# Altium project USB-Hub.PrjPcb
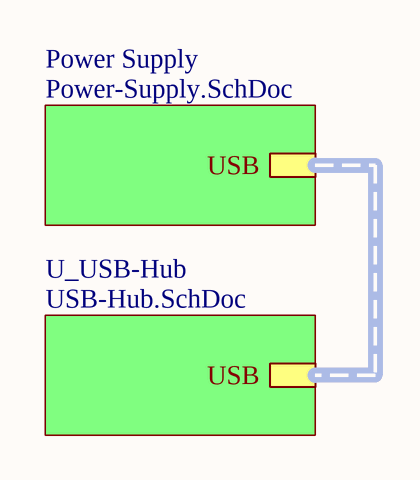
[diagram p0: Block-Diagram.SchDoc]
4 sheets, 161 parts. Net scope: hierarchical (ports join the sheet entries above them; power ports are global).
Board file: PCB.PcbDoc
Sheets:
  Block-Diagram.SchDoc
    Power Supply = Power-Supply.SchDoc
    U_USB-Hub = USB-Hub.SchDoc
      USB-Port1 = USB-Port.SchDoc
      USB-Port2 = USB-Port.SchDoc
      USB-Port3 = USB-Port.SchDoc
      USB-Port4 = USB-Port.SchDoc
      USB-Port5 = USB-Port.SchDoc
      USB-Port6 = USB-Port.SchDoc
      USB-Port7 = USB-Port.SchDoc

## Sheet Block-Diagram.SchDoc: Overkill USB HUB
size A4; Revision: 1.0; SheetNumber: 1

### Sub-sheets
Power Supply = Power-Supply.SchDoc: USB (harness USB-Input)
U_USB-Hub = USB-Hub.SchDoc: USB (harness USB-Input)

### Buses and harness runs
harness sheet Power Supply/USB = sheet U_USB-Hub/USB

### Notes on the sheet
- Projeto:
- Tamanho:
- Data:
- A4
- Eng. Felipe Navarro
- Hora:
- Revisão:
- Folha
- de
- Arquivo:

## Sheet Power-Supply.SchDoc: Power Supply
size A4; Revision: 1.0
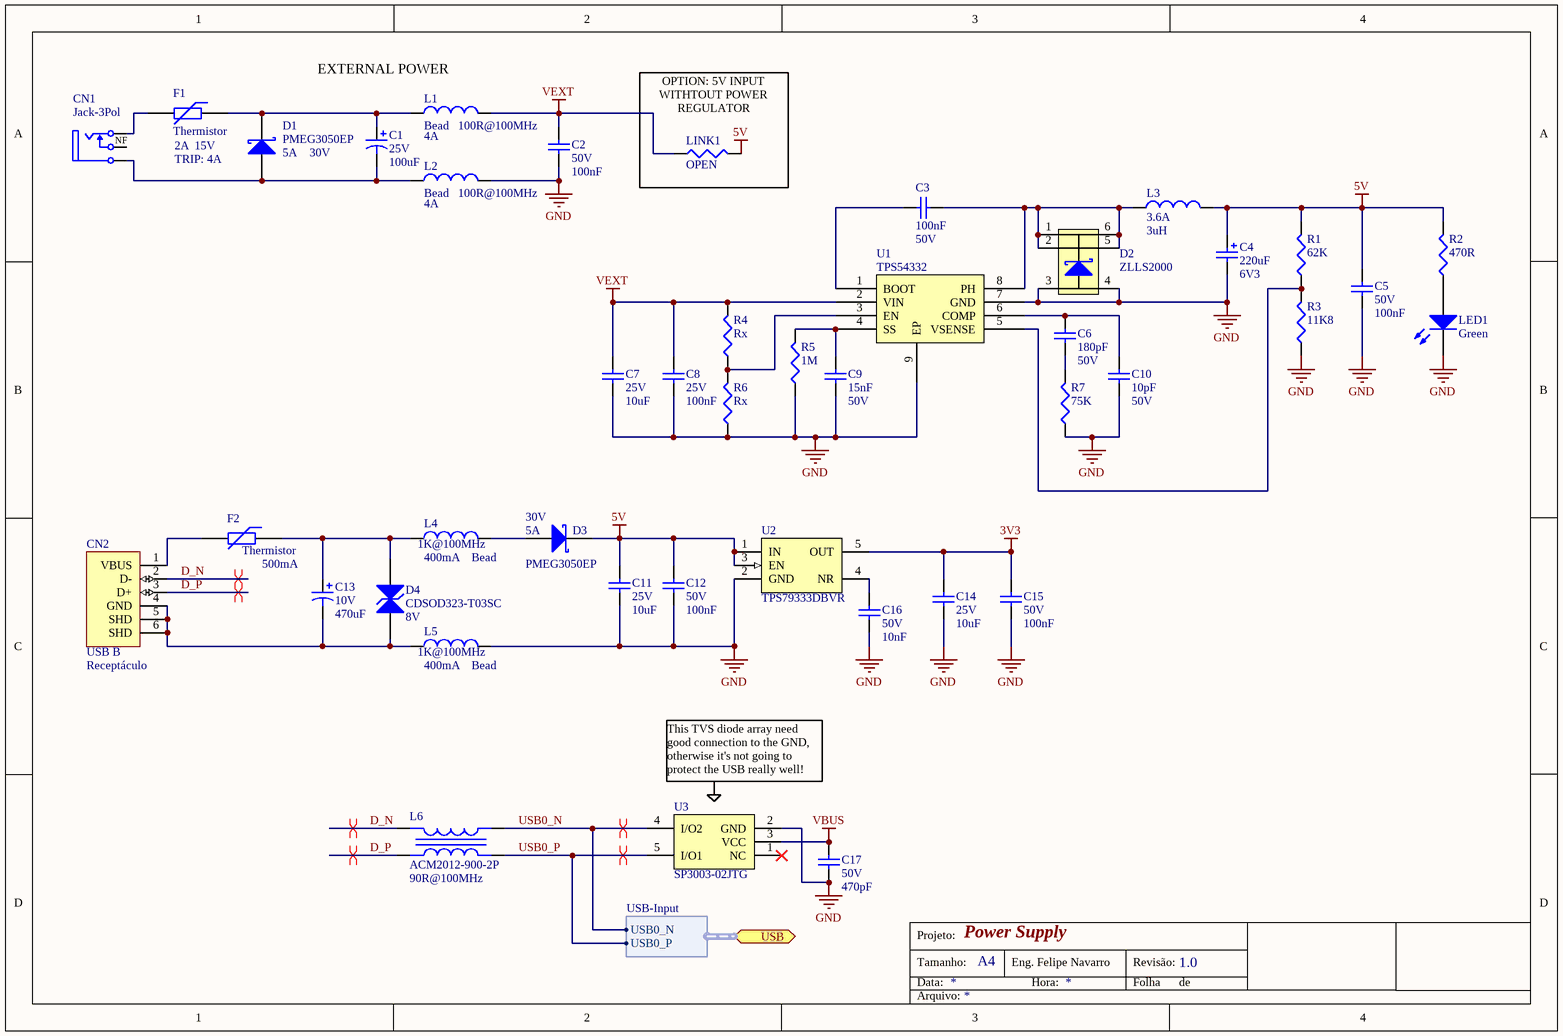
[diagram p1: Power-Supply.SchDoc]

### Parts
C1  value 100uF  Tensão: 25V  [CPOLRAD8X14]  (hidden comment: Capacitor Eletrolítico)
C2  value 100nF  Tensão: 50V  [CC0603]  (hidden comment: Capacitor Cerâmico)
C3  value 100nF  Tensão: 50V  [CC0603]  (hidden comment: Capacitor Cerâmico)
C4  value 220uF  Tensão: 6V3  [CPOL2917]  (hidden comment: Capacitor Tântalo)
C5  value 100nF  Tensão: 50V  [CC0603]  (hidden comment: Capacitor Cerâmico)
C6  value 180pF  Tensão: 50V  [CC0603]  (hidden comment: Capacitor Cerâmico)
C7  value 10uF  Tensão: 25V  [CC0805]  (hidden comment: Capacitor Cerâmico)
C8  value 100nF  Tensão: 25V  [CC0603]  (hidden comment: Capacitor Cerâmico)
C9  value 15nF  Tensão: 50V  [CC0603]  (hidden comment: Capacitor Cerâmico)
C10  value 10pF  Tensão: 50V  [CC0603]  (hidden comment: Capacitor Cerâmico)
C11  value 10uF  Tensão: 25V  [CC0805]  (hidden comment: Capacitor Cerâmico)
C12  value 100nF  Tensão: 50V  [CC0603]  (hidden comment: Capacitor Cerâmico)
C13  value 470uF  Tensão: 10V  [CPOLRAD6X12]  (hidden comment: Capacitor Eletrolítico)
C14  value 10uF  Tensão: 25V  [CC0805]  (hidden comment: Capacitor Cerâmico)
C15  value 100nF  Tensão: 50V  [CC0603]  (hidden comment: Capacitor Cerâmico)
C16  value 10nF  Tensão: 50V  [CC0603]  (hidden comment: Capacitor Cerâmico)
C17  value 470pF  Tensão: 50V  [CC0603]  (hidden comment: Capacitor Cerâmico)
CN1  Jack-3Pol  [CONN_JACK-FONTE_3N]
CN2  USB B  value Receptáculo  [CONN_USB-B_RCPT-H]
D1  PMEG3050EP  Corrente: 5A  Tensão: 30V  [SOD-128]
D2  ZLLS2000  [SOT-23-6N]
D3  PMEG3050EP  Corrente: 5A  Tensão: 30V  [SOD-128]
D4  CDSOD323-T03SC  Tensão: 8V  [SOD-323 BIDIRECT]
F1  Thermistor  Corrente: 2A  Tensão: 15V  Obs: TRIP: 4A  [CC1210]
F2  Thermistor  Corrente: 500mA  [CC1812]
L1  Bead  value 100R@100MHz  Corrente: 4A  [CC0805]
L2  Bead  value 100R@100MHz  Corrente: 4A  [CC0805]
L3  value 3uH  Corrente: 3.6A  [NR2424]  (hidden comment: Indutor)
L4  Bead  value 1K@100MHz  Corrente: 400mA  [CC0603]
L5  Bead  value 1K@100MHz  Corrente: 400mA  [CC0603]
L6  ACM2012-900-2P  value 90R@100MHz  [TR0805-4N]
LED1  value Green  [LED-INDIC]  (hidden comment: LED)
LINK1  value OPEN  [CC1210]  (hidden comment: Resistor Open)  (no BOM)
R1  value 62K  [CC0603]  (hidden comment: Resistor)
R2  value 470R  [CC0603]  (hidden comment: Resistor)
R3  value 11K8  [CC0603]  (hidden comment: Resistor)
R4  value Rx  [CC0603]  (hidden comment: Resistor)
R5  value 1M  [CC0603]  (hidden comment: Resistor)
R6  value Rx  [CC0603]  (hidden comment: Resistor)
R7  value 75K  [CC0603]  (hidden comment: Resistor)
U1  TPS54332  [SOIC-8N-EP]
U2  TPS79333DBVR  [SOT-23-5N]
U3  SP3003-02JTG  [SC70-5N]

### Ports
USB (harness USB-Input)

### Harnesses
USB-Input: USB0_N, USB0_P

### Nets
3V3: C14.2 C15.2 U2.5(OUT)
5V: C4.1 C5.2 C11.2 C12.2 D3.2(K) L3.2 LINK1.2 R1.2 R2.2 U2.1(IN) U2.3(EN)
GND: C2.1 C4.2 C5.1 C7.1 C8.1 C9.1 C10.1 C11.1 C12.1 C14.1 C15.1 C16.1 C17.1 D2.3(A) D2.4(A) L2.2 L5.2 LED1.2(K) R3.1 R5.1 R6.1 R7.1 U1.7(GND) U1.9(EP) U2.2(GND) U3.2(GND)
VBUS: C17.2 U3.3(VCC)
VEXT: C2.2 C7.2 C8.2 L1.2 LINK1.1 R4.2 U1.2(VIN)
D_N: CN2.2(D-) L6.1(Pri+)
D_P: CN2.3(D+) L6.2(Pri-)
USB0_N: L6.4(Sec-) U3.4(I/O2) ; port USB.USB0_N
USB0_P: L6.3(Sec+) U3.5(I/O1) ; port USB.USB0_P
NetC1_1: C1.1 D1.2(K) F1.1 L1.1
NetC1_2: C1.2 CN1.2(Malha) D1.1(A) L2.1
NetC3_1: C3.1 D2.1(C) D2.2(C) D2.5(C) D2.6(C) L3.1 U1.8(PH)
NetC3_2: C3.2 U1.1(BOOT)
NetC6_1: C6.1 R7.2
NetC6_2: C6.2 C10.2 U1.6(COMP)
NetC9_2: C9.2 R5.2 U1.4(SS)
NetC13_1: C13.1 D4.2(K) F2.1 L4.1
NetC13_2: C13.2 CN2.4(GND) CN2.5(SHD) CN2.6(SHD) D4.1(A) L5.1
NetC16_2: C16.2 U2.4(NR)
NetCN1_1: CN1.1(Centro) F1.2
NetCN2_1: CN2.1(VBUS) F2.2
NetD3_1: D3.1(A) L4.2
NetLED1_1: LED1.1(A) R2.1
NetR1_1: R1.1 R3.2 U1.5(VSENSE)
NetR4_1: R4.1 R6.2 U1.3(EN)

Not connected (* = marked no-connect by the designer): CN1 3(NF); U3 1(NC)*

### Layout directives
differential pair: D_N, D_P, USB0_N, USB0_P

### Notes on the sheet
- (near L1) EXTERNAL POWER
- (near LINK1) OPTION: 5V INPUT WITHTOUT POWER REGULATOR
- This TVS diode array need good connection to the GND, otherwise it's not going to protect the USB really well!
- Projeto:
- Tamanho:
- Data:
- A4
- Eng. Felipe Navarro
- Hora:
- Revisão:
- Folha
- de
- Arquivo:

### Library data of the parts
C1 = PCap 100uF 25V 8d.x14h.: Polarized Capacitor (Radial); ChinesePrice: 0,00000; Chinês: ----; Corrente: *A; Potência: *W; Obs: Alumínio; Tolerância: ±20%; Supplier 1: Digi-Key; Supplier Part Number 1: 493-4496-1-ND; ComponentLink1Description: Datasheet; ComponentLink1URL: D:\Tecnoclade\Datasheet\!DataMissing.pdf
C2 C5 C12 C15 = Cap 100nF 50V 0603 X7R: Capacitor (Semiconductor SIM Model); Chinês: Local; ChinesePrice: 0,00250; Corrente: *A; Potência: *W; Obs:: X7R; Tolerância: ±10%; Supplier 1: Digi-Key; Supplier Part Number 1: 1276-1000-1-ND; ComponentLink1Description: Datasheet; ComponentLink1URL: D:\Tecnoclade\Datasheet\!DataMissing.pdf
C3 = Cap 100nF 50V 0603 X7R: Capacitor (Semiconductor SIM Model); ChinesePrice: 0,00250; Chinês: Local; Corrente: *A; Potência: *W; Tolerância: ±10%; Obs:: X7R; Supplier 1: Digi-Key; Supplier Part Number 1: 1276-1000-1-ND; ComponentLink1Description: Datasheet; ComponentLink1URL: D:\Tecnoclade\Datasheet\!DataMissing.pdf
C4 = PCap 220uF 6V3 2917 LOESR: Polarized Capacitor; ChinesePrice: 0,28500; Chinês: Local; Corrente: 3.5A (Ripple); Potência: *W; Obs: LOESR (0R009); Tolerância: ±20%; Supplier 1: Digi-Key; Supplier Part Number 1: 1189-1687-1-ND; ComponentLink1Description: Datasheet; ComponentLink1URL: D:\Tecnoclade\Datasheet\!DataMissing.pdf
C6 = Cap 180pF 50V 0603 NP0: Capacitor (Semiconductor SIM Model); ChinesePrice: 0,00360; Chinês: Local; Corrente: *A; Potência: *W; Tolerância: ±5%; Obs:: NP0; Supplier 1: Digi-Key; Supplier Part Number 1: 1276-1255-1-ND; ComponentLink1Description: Datasheet; ComponentLink1URL: D:\Tecnoclade\Datasheet\!DataMissing.pdf
C7 C11 C14 = Cap 10uF 25V 0805 X5R: Capacitor (Semiconductor SIM Model); Chinês: Local; ChinesePrice: 0,02620; Corrente: *A; Potência: *W; Obs:: X5R; Tolerância: ±10%; Supplier 1: Digi-Key; Supplier Part Number 1: 587-2985-1-ND; ComponentLink1Description: Datasheet; ComponentLink1URL: D:\Tecnoclade\Datasheet\!DataMissing.pdf
C8 = Cap 100nF 25V 0603 X7R: Capacitor (Semiconductor SIM Model); Chinês: Local; ChinesePrice: 0,00246; Corrente: *A; Potência: *W; Obs:: X7R; Tolerância: ±10%; Supplier 1: Digi-Key; Supplier Part Number 1: 490-1524-1-ND; ComponentLink1Description: Datasheet; ComponentLink1URL: D:\Tecnoclade\Datasheet\!DataMissing.pdf
C9 = Cap 15nF 50V 0603 X7R: Capacitor (Semiconductor SIM Model); ChinesePrice: 0,00500; Chinês: Local; Corrente: *A; Potência: *W; Tolerância: ±10%; Obs:: X7R; Supplier 1: Digi-Key; Supplier Part Number 1: 445-5189-1-ND; ComponentLink1Description: Datasheet; ComponentLink1URL: D:\Tecnoclade\Datasheet\!DataMissing.pdf
C10 = Cap 10pF 50V 0603 NP0 5%: Capacitor (Semiconductor SIM Model); ChinesePrice: 0,00180; Chinês: Local; Corrente: *A; Potência: *W; Tolerância: ±5%; Obs:: NP0; Supplier 1: Digi-Key; Supplier Part Number 1: 445-1269-1-ND; ComponentLink1Description: Datasheet; ComponentLink1URL: D:\Tecnoclade\Datasheet\!DataMissing.pdf
C13 = PCap 470uF 10V 6d.x12h.: Polarized Capacitor (Radial); ChinesePrice: 0,00000; Chinês: ----; Corrente: *A; Potência: *W; Obs: ESH477M010AE3AA - Alumínio; Tolerância: ±20%; Supplier 1: Digi-Key; Supplier Part Number 1: 399-6589-ND; ComponentLink1Description: Datasheet; ComponentLink1URL: D:\Tecnoclade\Datasheet\!DataMissing.pdf
C16 = Cap 10nF 50V 0603 X7R 5%: Capacitor (Semiconductor SIM Model); Chinês: Local; ChinesePrice: 0,00320; Corrente: *A; Potência: *W; Obs:: X7R; Tolerância: ±5%; Supplier 1: Digi-Key; Supplier Part Number 1: 399-1092-1-ND; ComponentLink1Description: Datasheet; ComponentLink1URL: D:\Tecnoclade\Datasheet\!DataMissing.pdf
C17 = Cap 470pF 50V 0603 X7R: Capacitor (Semiconductor SIM Model); Chinês: Local; ChinesePrice: 0,00180; Corrente: *A; Potência: *W; Obs:: X7R; Tolerância: ±10%; Supplier 1: Digi-Key; Supplier Part Number 1: 399-1075-1-ND; ComponentLink1Description: Datasheet; ComponentLink1URL: D:\Tecnoclade\Datasheet\!DataMissing.pdf
CN1 = Jack-3Pol: Jack Socket, Thru-Hole, Vertical, 2 Conductors, 3 Contacts Single Switch, Normally Closed; ChinesePrice: 0,06600; Chinês: Local; Corrente: 5A; Tensão: 16VDC; Value: Receptáculo - 3Pol; Supplier 1: Digi-Key; Potência: *; Obs:: *; Tolerância: *; ComponentLink1Description: Datasheet; Supplier Part Number 1: CP-202BH-ND
CN2 = USB B RCPT-H: Conector Jack USB B, Through Hole, Right Angle, Horizontal; ChinesePrice: 0,00000; Chinês: ----; Obs:: USB 2.0; Corrente: *; Potência: *; Supplier 1: Digi-Key; Supplier Part Number 1: A31725-ND; Tensão: *; Tolerância: *; ComponentLink1Description: Datasheet; ComponentLink1URL: D:\Tecnoclade\Datasheet\!DataMissing.pdf
D1 D3 = DS 30V 5A SOD-128: Schottky Diode; ChinesePrice: 0,16100; Chinês: Local; Value: Vf=360mV @ 5A; Obs: Fast Recovery =< 500ns, > 200mA (Io); Supplier 1: Digi-Key; Supplier Part Number 1: 568-6753-1-ND; ComponentLink1Description: Datasheet; ComponentLink1URL: D:\Tecnoclade\Datasheet\!DataMissing.pdf
D2 = ZLLS2000: Power Shottky; Tensão: 40V; Corrente: 2.2A; ChinesePrice: 0,33990; Chinês: Local; Supplier 1: Digi-Key; Supplier Part Number 1: ZLLS2000CT-ND; Potência: *; Value: *; ComponentLink1Description: Datasheet; ComponentLink1URL: D:\Tecnoclade\Datasheet\!DataMissing.pdf; Tolerância: *; Obs:: *
D4 = TVS 8V 5% SOD323 BI 400W: Transient Voltage Supressor diode; ChinesePrice: 0,00000; Chinês: ----; Corrente: 43A; Potência: 400W; Value: 200pF@1MHz; Obs:: Bidirecional; Tolerância: ±*%; Supplier 1: Digi-Key; Supplier Part Number 1: CDSOD323-T03SCCT-ND; ComponentLink1Description: Datasheet; ComponentLink1URL: D:\Tecnoclade\Datasheet\!DataMissing.pdf
F1 = Res Varistor: Varistor (Voltage-Sensitive Resistor); ChinesePrice: 0,09500; Chinês: Local; Supplier 1: Digi-Key; Supplier Part Number 1: 507-1792-1-ND; ComponentLink1Description: Datasheet; ComponentLink1URL: D:\Tecnoclade\Datasheet\!DataMissing.pdf
F2 = Res Varistor: Varistor (Voltage-Sensitive Resistor); Tensão: 15V; ChinesePrice: 0,09500; Chinês: Local; Obs: TRIP: 1A; Supplier 1: Digi-Key; Supplier Part Number 1: 507-1762-1-ND; ComponentLink1Description: Datasheet; ComponentLink1URL: D:\Tecnoclade\Datasheet\!DataMissing.pdf
L1 L2 = Bd 180R@100MHz 1806 3A: ChinesePrice: 0,00000; Chinês: -----; Obs:: Ferrite (0R025); Tolerância: ±*%; Potência: *; Supplier 1: Digi-Key; Supplier Part Number 1: 445-1567-1-ND; Tensão: *; ComponentLink1Description: Datasheet; ComponentLink1URL: D:\Tecnoclade\Datasheet\!DataMissing.pdf
L3 = Ind 3uH 2424 3.6A: Inductor; ChinesePrice: 0,00000; Chinês: ----; Obs:: (0R023)@100MHz; Tolerância: ±30%; Potência: *; Supplier 1: Digi-Key; Supplier Part Number 1: 587-2099-1-ND; Tensão: *; ComponentLink1Description: Datasheet; ComponentLink1URL: D:\Tecnoclade\Datasheet\!DataMissing.pdf
L4 L5 = Bd 1K@100MHz 0603 400mA: ChinesePrice: 0,00000; Chinês: -----; Obs:: Ferrite (0R5); Tolerância: ±25%; Potência: *; Supplier 1: Digi-Key; Supplier Part Number 1: 445-1550-1-ND; Tensão: *; ComponentLink1Description: Datasheet; ComponentLink1URL: D:\Tecnoclade\Datasheet\!DataMissing.pdf; Substituição: 27/06/2014
L6 = ACM2012-900-2P: Indutor de Modo Comum; Corrente: 400mA; ChinesePrice: 0,19100; Chinês: Local; Potência: *W; Tensão: *V; Tolerância: ±*%; Obs:: Z=0R19; Supplier Part Number 1: 445-2207-1-ND; Supplier 1: Digi-Key; ComponentLink1Description: Datasheet; ComponentLink1URL: D:\Tecnoclade\Datasheet\!DataMissing.pdf; Substituição: 00/00/0000
LED1 = LED2: Typical RED, GREEN, YELLOW, AMBER GaAs LED; ChinesePrice: 0,00000; Chinês: ----; VertSimCode: } XXXXX {; Supplier 1: Digi-Key; Supplier Part Number 1: 754-1297-ND
LINK1 = Res Open 0603: Resistor; ChinesePrice: 0,00000; Chinês: ----; Corrente: *A; Potência: *W; Tensão: *V; Tolerância: ±*%; Supplier 1: Digi-Key; Supplier Part Number 1: --Del; Obs:: *; ComponentLink1Description: Datasheet; ComponentLink1URL: D:\Tecnoclade\Datasheet\!DataMissing.pdf
R1 = Res 62K 1% 0603 1/10W: Potência: 1/10W; ChinesePrice: 0,00089; Chinês: Local; Corrente: *A; Tensão: *V; Tolerância: ±1%; Supplier 1: Digi-Key; Supplier Part Number 1: 311-62.0KHRCT-ND; ComponentLink1Description: Datasheet; ComponentLink1URL: D:\Tecnoclade\Datasheet\!DataMissing.pdf; Obs: *
R2 = Res 470R 5% 0603 1/10W: ChinesePrice: 0,00000; Chinês: ----; Corrente: *A; Potência: 1/10W; Tensão: *V; Obs: ±200ppm/ºC; Tolerância: ±5%; Supplier 1: Digi-Key; Supplier Part Number 1: RMCF0603JT470RCT-ND; ComponentLink1Description: Datasheet; ComponentLink1URL: D:\Tecnoclade\Datasheet\!DataMissing.pdf
R3 = Res 11K8 1% 0603 1/10W: Potência: 1/10W; ChinesePrice: 0,00089; Chinês: Local; Corrente: *A; Tensão: *V; Tolerância: ±1%; Supplier 1: Digi-Key; Supplier Part Number 1: 311-11.8KHRCT-ND; ComponentLink1Description: Datasheet; ComponentLink1URL: D:\Tecnoclade\Datasheet\!DataMissing.pdf; Obs: *
R4 = Res 150K 1% 0603 1/10W: Potência: 1/10W; ChinesePrice: 0,00089; Chinês: Local; Corrente: *A; Tensão: *V; Tolerância: ±1%; Supplier 1: Digi-Key; Supplier Part Number 1: P150KHCT-ND; ComponentLink1Description: Datasheet; ComponentLink1URL: D:\Tecnoclade\Datasheet\!DataMissing.pdf; Obs: *
R5 = Res 1M 1% 0603 1/10W: Potência: 1/10W; ChinesePrice: 0,00089; Chinês: Local; Corrente: *A; Tensão: *V; Obs: ±100ppm/ºC; Tolerância: ±1%; Supplier 1: Digi-Key; Supplier Part Number 1: RMCF0603FT1M00CT-ND; ComponentLink1Description: Datasheet; ComponentLink1URL: D:\Tecnoclade\Datasheet\!DataMissing.pdf
R6 = Res 48K7 1% 0603 1/10W: Potência: 1/10W; ChinesePrice: 0,00089; Chinês: Local; Corrente: *A; Tensão: *V; Tolerância: ±1%; Supplier 1: Digi-Key; Supplier Part Number 1: P48.7KHCT-ND; ComponentLink1Description: Datasheet; ComponentLink1URL: D:\Tecnoclade\Datasheet\!DataMissing.pdf; Obs: *
R7 = Res 75K 1% 0603 1/10W: Potência: 1/10W; ChinesePrice: 0,00100; Chinês: Local; Corrente: *A; Tensão: *V; Obs: ±100ppm/ºC; Tolerância: ±1%; Supplier 1: Digi-Key; Supplier Part Number 1: P75.0KHCT-ND; ComponentLink1Description: Datasheet; ComponentLink1URL: D:\Tecnoclade\Datasheet\!DataMissing.pdf
U1 = TPS54332: DC/DC Converter Step-Down 3.5A 28V; ChinesePrice: 0,87200; Chinês: TI; Corrente: 3.5A; Supplier 1: Digi-Key; Supplier Part Number 1: 296-24141-5-ND; ComponentLink1Description: Datasheet; ComponentLink1URL: D:\Tecnoclade\Datasheet\!DataMissing.pdf
U2 = TPS79333: ULTRALOW-NOISE, HIGH PSRR, FAST RF 200mA LOW-DROPOUT LINEAR  REGULATORS I; Tensão: 3V3; ChinesePrice: 0,00000; Chinês: ----; Corrente: 200mA; Potência: *; Supplier 1: Digi-Key; Supplier Part Number 1: 296-12961-1-ND; Value: *; Obs:: *; Tolerância: *; ComponentLink1Description: Datasheet; ComponentLink1URL: D:\Tecnoclade\Datasheet\
U3 = SP3003-02JTG: TVS DIODE ARRAY; Value: 0.65pF; Tensão: 6V; Supplier Part Number 1: F3301CT-ND; Supplier 1: Digi-Key

## Sheet USB-Hub.SchDoc: USB HUB
size A4; Revision: 1.0; SheetNumber: 2
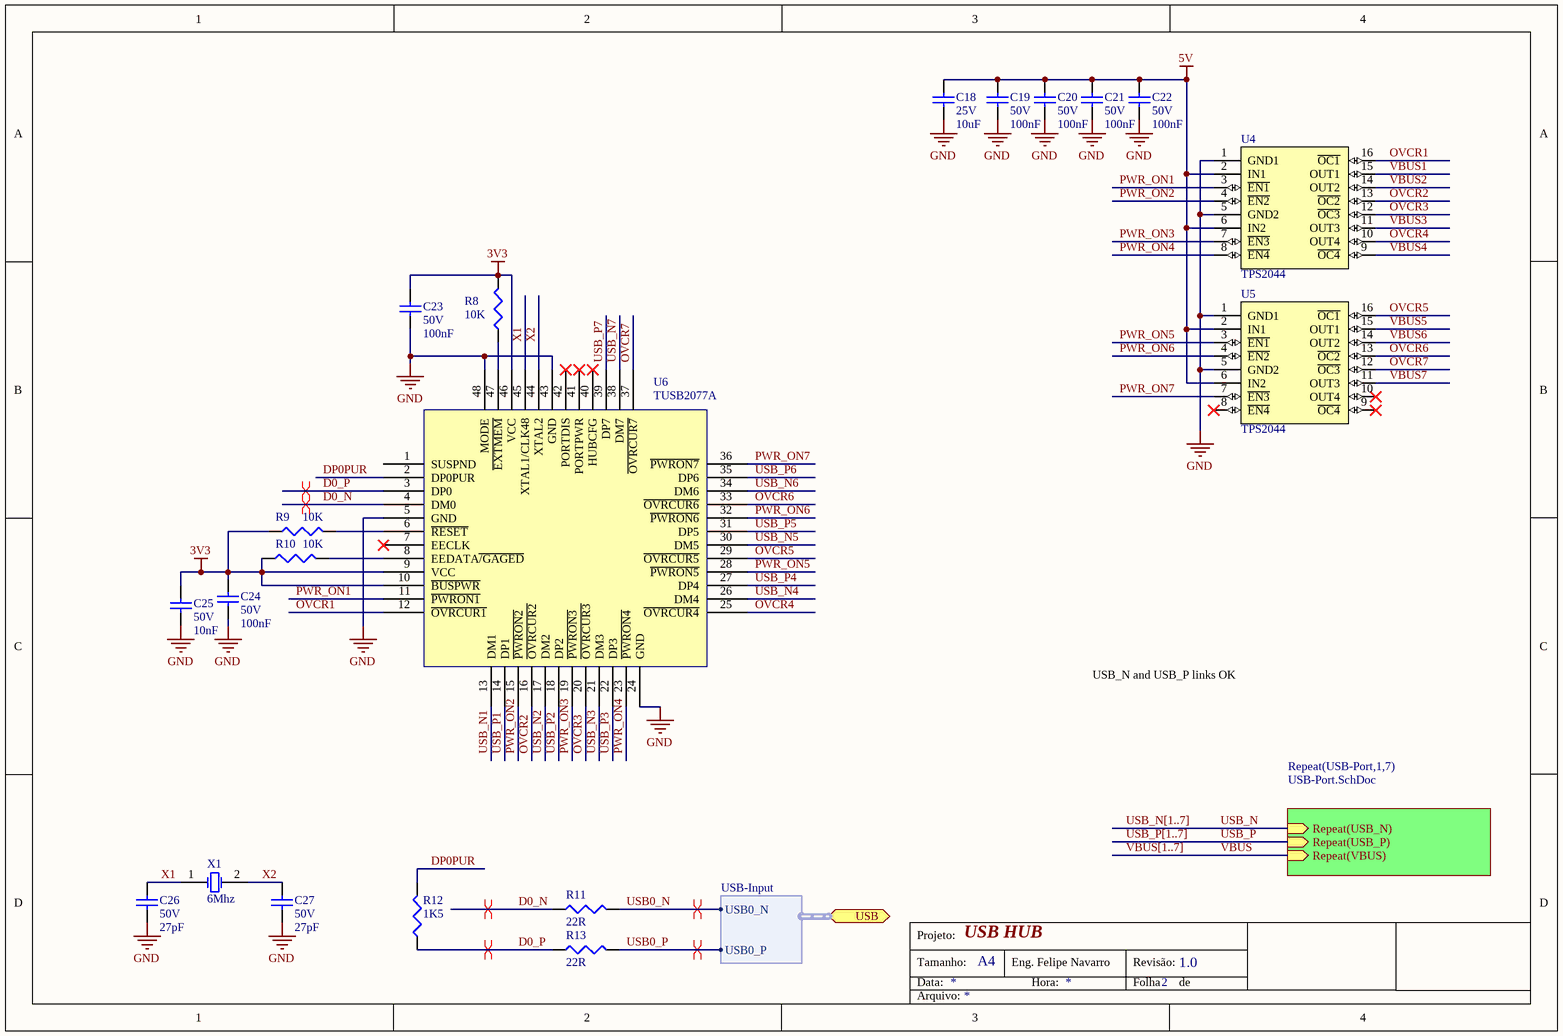
[diagram p2: USB-Hub.SchDoc]

### Parts
C18  value 10uF  Tensão: 25V  [CC0805]  (hidden comment: Capacitor Cerâmico)
C19  value 100nF  Tensão: 50V  [CC0603]  (hidden comment: Capacitor Cerâmico)
C20  value 100nF  Tensão: 50V  [CC0603]  (hidden comment: Capacitor Cerâmico)
C21  value 100nF  Tensão: 50V  [CC0603]  (hidden comment: Capacitor Cerâmico)
C22  value 100nF  Tensão: 50V  [CC0603]  (hidden comment: Capacitor Cerâmico)
C23  value 100nF  Tensão: 50V  [CC0603]  (hidden comment: Capacitor Cerâmico)
C24  value 100nF  Tensão: 50V  [CC0603]  (hidden comment: Capacitor Cerâmico)
C25  value 10nF  Tensão: 50V  [CC0603]  (hidden comment: Capacitor Cerâmico)
C26  value 27pF  Tensão: 50V  [CC0603]  (hidden comment: Capacitor Cerâmico)
C27  value 27pF  Tensão: 50V  [CC0603]  (hidden comment: Capacitor Cerâmico)
R8  value 10K  [CC0603]  (hidden comment: Resistor)
R9  value 10K  [CC0603]  (hidden comment: Resistor)
R10  value 10K  [CC0603]  (hidden comment: Resistor)
R11  value 22R  [CC0603]  (hidden comment: Resistor)
R12  value 1K5  [CC0603]  (hidden comment: Resistor)
R13  value 22R  [CC0603]  (hidden comment: Resistor)
U4  TPS2044  [SOIC-16N]
U5  TPS2044  [SOIC-16N]
U6  TUSB2077A  [TQFP-48N]
X1  6Mhz  [HC/49US]

### Sub-sheets
Repeat(USB-Port,1,7) = USB-Port.SchDoc: Repeat(USB_N) (in), Repeat(USB_P) (in), Repeat(VBUS) (in)

### Ports
USB (harness USB-Input)

### Harnesses
USB-Input: USB0_N, USB0_P

### Nets
3V3: C23.2 C24.2 C25.2 R8.2 R9.1 R10.1 U6.9(VCC) U6.10(~{BUSPWR}) U6.46(VCC)
5V: C18.2 C19.2 C20.2 C21.2 C22.2 U4.2(IN1) U4.6(IN2) U5.2(IN1) U5.6(IN2)
GND: C18.1 C19.1 C20.1 C21.1 C22.1 C23.1 C24.1 C25.1 C26.1 C27.1 U4.1(GND1) U4.5(GND2) U5.1(GND1) U5.5(GND2) U6.5(GND) U6.24(GND) U6.43(GND) U6.48(MODE)
D0_N: R11.1 U6.4(DM0)
D0_P: R12.1 R13.1 U6.3(DP0)
DP0PUR: R12.2 U6.2(DP0PUR)
OVCR1: U4.16(~{OC1}) U6.12(~{OVRCUR1})
OVCR2: U4.13(~{OC2}) U6.16(~{OVRCUR2})
OVCR3: U4.12(~{OC3}) U6.20(~{OVRCUR3})
OVCR4: U4.10(OUT4) U6.25(~{OVRCUR4})
OVCR5: U5.16(~{OC1}) U6.29(~{OVRCUR5})
OVCR6: U5.13(~{OC2}) U6.33(~{OVRCUR6})
OVCR7: U5.12(~{OC3}) U6.37(~{OVRCUR7})
PWR_ON1: U4.3(~{EN1}) U6.11(~{PWRON1})
PWR_ON2: U4.4(~{EN2}) U6.15(~{PWRON2})
PWR_ON3: U4.7(~{EN3}) U6.19(~{PWRON3})
PWR_ON4: U4.8(~{EN4}) U6.23(~{PWRON4})
PWR_ON5: U5.3(~{EN1}) U6.28(~{PWRON5})
PWR_ON6: U5.4(~{EN2}) U6.32(~{PWRON6})
PWR_ON7: U5.7(~{EN3}) U6.36(~{PWRON7})
USB0_N: R11.2 ; port USB.USB0_N
USB0_P: R13.2 ; port USB.USB0_P
USB_N: sheet Repeat(USB-Port,1,7)/Repeat(USB_N)
USB_N1: U6.13(DM1)
USB_N2: U6.17(DM2)
USB_N3: U6.21(DM3)
USB_N4: U6.26(DM4)
USB_N5: U6.30(DM5)
USB_N6: U6.34(DM6)
USB_N7: U6.38(DM7)
USB_P: sheet Repeat(USB-Port,1,7)/Repeat(USB_P)
USB_P1: U6.14(DP1)
USB_P2: U6.18(DP2)
USB_P3: U6.22(DP3)
USB_P4: U6.27(DP4)
USB_P5: U6.31(DP5)
USB_P6: U6.35(DP6)
USB_P7: U6.39(DP7)
VBUS: sheet Repeat(USB-Port,1,7)/Repeat(VBUS)
VBUS1: U4.15(OUT1)
VBUS2: U4.14(OUT2)
VBUS3: U4.11(OUT3)
VBUS4: U4.9(~{OC4})
VBUS5: U5.15(OUT1)
VBUS6: U5.14(OUT2)
VBUS7: U5.11(OUT3)
X1: C26.2 U6.45(XTAL1/CLK48) X1.1(OSC1)
X2: C27.2 U6.44(XTAL2) X1.2(OSC2)
NetR8_1: R8.1 U6.47(~{EXTMEM})
NetR9_2: R9.2 U6.6(~{RESET})
NetR10_2: R10.2 U6.8(EEDATA~{/GAGED})

Not connected (* = marked no-connect by the designer): U5 8(~{EN4})* 9(~{OC4})* 10(OUT4)*; U6 1(SUSPND) 7(EECLK)* 40(HUBCFG)* 41(PORTPWR)* 42(PORTDIS)*

### Buses and harness runs
bus USB_N[1..7]
bus USB_P[1..7]
bus VBUS[1..7]

### Layout directives
differential pair: D0_N, D0_P, USB0_N, USB0_P

### Notes on the sheet
- USB_N and USB_P links OK
- Projeto:
- Tamanho:
- Data:
- A4
- Eng. Felipe Navarro
- Hora:
- Revisão:
- Folha
- de
- Arquivo:

### Library data of the parts
C18 = Cap 10uF 25V 0805 X5R: as C7 on sheet Power-Supply; Supplier 1: Digi-Key; Supplier Part Number 1: 587-2985-1-ND; ComponentLink1Description: Datasheet; ComponentLink1URL: D:\Tecnoclade\Datasheet\!DataMissing.pdf
C19-C24 = Cap 100nF 50V 0603 X7R: as C2 on sheet Power-Supply; Supplier 1: Digi-Key; Supplier Part Number 1: 1276-1000-1-ND; ComponentLink1Description: Datasheet; ComponentLink1URL: D:\Tecnoclade\Datasheet\!DataMissing.pdf
C25 = Cap 10nF 50V 0603 X7R 5%: as C16 on sheet Power-Supply; Supplier 1: Digi-Key; Supplier Part Number 1: 399-1092-1-ND; ComponentLink1Description: Datasheet; ComponentLink1URL: D:\Tecnoclade\Datasheet\!DataMissing.pdf
C26 C27 = Cap 27pF 50V 0603 NP0: Capacitor (Semiconductor SIM Model); Chinês: -----; ChinesePrice: 0,00000; Corrente: *A; Potência: *W; Obs:: NP0; Tolerância: ±5%; Supplier 1: Digi-Key; Supplier Part Number 1: 445-1274-1-ND; ComponentLink1Description: Datasheet; ComponentLink1URL: D:\Tecnoclade\Datasheet\!DataMissing.pdf
R8-R10 = Res 10K 1% 0603 1/10W: ChinesePrice: 0,00089; Chinês: Local; Corrente: *A; Potência: 1/10W; Tensão: *V; Tolerância: ±1%; Supplier 1: Digi-Key; Supplier Part Number 1: P10.0KHCT-ND; Obs: *; ComponentLink1Description: Datasheet; ComponentLink1URL: D:\Tecnoclade\Datasheet\!DataMissing.pdf
R11 R13 = Res 22R 1% 0603 1/10W: ChinesePrice: 0,00000; Chinês: ----; Corrente: *A; Potência: 1/10W; Tensão: *V; Obs: ±100ppm/ºC; Tolerância: ±1%; Supplier 1: Digi-Key; Supplier Part Number 1: RMCF0603FT22R0CT-ND; ComponentLink1Description: Datasheet; ComponentLink1URL: D:\Tecnoclade\Datasheet\!DataMissing.pdf
R12 = Res 1K5 1% 0603 1/10W: ChinesePrice: 0,00000; Chinês: ----; Corrente: *A; Potência: 1/10W; Tensão: *V; Obs: ±100ppm/ºC; Tolerância: ±1%; Supplier 1: Digi-Key; Supplier Part Number 1: 311-1.50KHRCT-ND; ComponentLink1Description: Datasheet; ComponentLink1URL: D:\Tecnoclade\Datasheet\!DataMissing.pdf
U4 U5 = TPS2044: QUAD POWER-DISTRIBUTION SWITCH; ChinesePrice: 0,00000; Chinês: ----; Tensão: 2V3 ~ 5V5; Corrente: *; Potência: *; Value: *; Supplier 1: Digi-Key; Supplier Part Number 1: 296-18931-5-ND; Obs:: *; Tolerância: *; ComponentLink1Description: *; ComponentLink1URL: *; ComponentLink2URL: *; ComponentLink2Description: *
U6 = TUSB2077A: USB HUB 7 Port; ChinesePrice: 0,00000; Chinês: ----; Corrente: *; Potência: *; Supplier 1: Digi-Key; Supplier Part Number 1: 296-37871-1-ND; Tensão: *; Obs:: *; Tolerância: *; ComponentLink1Description: Datasheet; ComponentLink1URL: *
X1 = XTAL: Crystal Oscillator; ChinesePrice: 0,00000; Chinês: ----; Value: 20pF/40R; Corrente: *; Potência: *; Supplier 1: Digi-Key; Supplier Part Number 1: --Del; Tensão: *; Obs:: *; Tolerância: *

## Sheet USB-Port.SchDoc: External USB Port
size A4; Revision: 1.0
Used 7 times, as channels U_USB-Hub/USB-Port1, U_USB-Hub/USB-Port2, U_USB-Hub/USB-Port3, U_USB-Hub/USB-Port4, U_USB-Hub/USB-Port5, U_USB-Hub/USB-Port6, U_USB-Hub/USB-Port7. Parts and nets are listed once, with the designators drawn on the sheet.
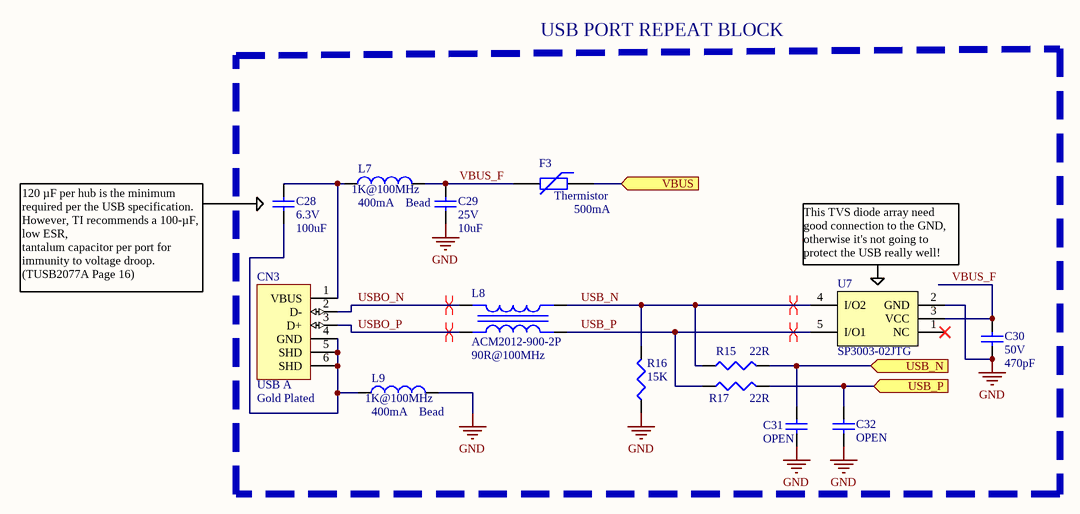
[diagram p3: USB-Port.SchDoc]

### Parts
C28  value 100uF  Tensão: 6.3V  [CC1206]  (hidden comment: Capacitor Cerâmico)
C29  value 10uF  Tensão: 25V  [CC0805]  (hidden comment: Capacitor Cerâmico)
C30  value 470pF  Tensão: 50V  [CC0603]  (hidden comment: Capacitor Cerâmico)
C31  value OPEN  [CC0603]  (hidden comment: Capacitor Cerâmico)  (no BOM)
C32  value OPEN  [CC0603]  (hidden comment: Capacitor Cerâmico)  (no BOM)
CN3  USB A  value Gold Plated  [CONN_USB-A_RCPT-V - AMP FCI]
F3  Thermistor  Corrente: 500mA  [CC1812]
L7  Bead  value 1K@100MHz  Corrente: 400mA  [CC0603]
L8  ACM2012-900-2P  value 90R@100MHz  [TR0805-4N]
L9  Bead  value 1K@100MHz  Corrente: 400mA  [CC0603]
R15  value 22R  [CC0603]  (hidden comment: Resistor)
R16  value 15K  [CC0603]  (hidden comment: Resistor)
R17  value 22R  [CC0603]  (hidden comment: Resistor)
U7  SP3003-02JTG  [SC70-5N]

### Blocks framed on the sheet
USB PORT REPEAT BLOCK: C28-C32 CN3 F3 L7-L9 R15-R17 U7

### Ports
USB_N (in), USB_P (in), VBUS (in)

### Nets
GND: C29.1 C30.1 C31.1 C32.1 L9.2 R16.1 U7.2(GND)
USB_N: L8.2(Pri-) R15.1 R16.2 U7.4(I/O2)
USB_N: C31.2 R15.2 ; port USB_N  [a separate net that carries the same name]
USB_P: L8.1(Pri+) R17.1 U7.5(I/O1)
USB_P: C32.2 R17.2 ; port USB_P  [a separate net that carries the same name]
USBO_N: CN3.2(D-) L8.3(Sec+)
USBO_P: CN3.3(D+) L8.4(Sec-)
VBUS: F3.1 ; port VBUS
VBUS_F: C29.2 C30.2 F3.2 L7.2 U7.3(VCC)
NetC28_1: C28.1 CN3.4(GND) CN3.5(SHD) CN3.6(SHD) L9.1
NetC28_2: C28.2 CN3.1(VBUS) L7.1

Not connected (* = marked no-connect by the designer): U7 1(NC)*

### Channels
U_USB-Hub/USB-Port1: designators end in .1; ports USB_N=USB_N1 USB_P=USB_P1 VBUS=VBUS1
U_USB-Hub/USB-Port2: designators end in .2; ports USB_N=USB_N2 USB_P=USB_P2 VBUS=VBUS2
U_USB-Hub/USB-Port3: designators end in .3; ports USB_N=USB_N3 USB_P=USB_P3 VBUS=VBUS3
U_USB-Hub/USB-Port4: designators end in .4; ports USB_N=USB_N4 USB_P=USB_P4 VBUS=VBUS4
U_USB-Hub/USB-Port5: designators end in .5; ports USB_N=USB_N5 USB_P=USB_P5 VBUS=VBUS5
U_USB-Hub/USB-Port6: designators end in .6; ports USB_N=USB_N6 USB_P=USB_P6 VBUS=VBUS6
U_USB-Hub/USB-Port7: designators end in .7; ports USB_N=USB_N7 USB_P=USB_P7 VBUS=VBUS7

### Layout directives
differential pair: USB_N_USB-Port1, USB_P_USB-Port1, USBO_N_USB-Port1, USBO_P_USB-Port1

### Notes on the sheet
- 120 µF per hub is the minimum required per the USB specification. However, TI recommends a 100-µF, low ESR,
  tantalum capacitor per port for immunity to voltage droop. (TUSB2077A Page 16)
- (near U7) This TVS diode array need good connection to the GND, otherwise it's not going to protect the USB really well!
- Projeto:
- Tamanho:
- Data:
- A4
- Eng. Felipe Navarro
- Hora:
- Revisão:
- Folha
- de
- Arquivo:

### Library data of the parts
C28 = Cap 100uF 6.3V 1206 X5R: Capacitor (Semiconductor SIM Model); Chinês: -----; ChinesePrice: 0,00000; Corrente: *A; Potência: *W; Obs:: X5R; Tolerância: ±20%; Supplier 1: Digi-Key; Supplier Part Number 1: 490-7217-1-ND; ComponentLink1Description: Datasheet; ComponentLink1URL: D:\Tecnoclade\Datasheet\!DataMissing.pdf
C29 = Cap 10uF 25V 0805 X5R: as C7 on sheet Power-Supply; Supplier 1: Digi-Key; Supplier Part Number 1: 587-2985-1-ND; ComponentLink1Description: Datasheet; ComponentLink1URL: D:\Tecnoclade\Datasheet\!DataMissing.pdf
C30 = Cap 470pF 50V 0603 X7R: as C17 on sheet Power-Supply; Supplier 1: Digi-Key; Supplier Part Number 1: 399-1075-1-ND; ComponentLink1Description: Datasheet; ComponentLink1URL: D:\Tecnoclade\Datasheet\!DataMissing.pdf
C31 C32 = Cap OPEN 0603: Capacitor (Semiconductor SIM Model); Chinês: -----; ChinesePrice: 0,00000; Corrente: *A; Potência: *W; Tolerância: ±*%; Tensão: *V; Supplier 1: Digi-Key; Supplier Part Number 1: --Del; Obs:: *; ComponentLink1Description: Datasheet; ComponentLink1URL: D:\Tecnoclade\Datasheet\!DataMissing.pdf
CN3 = USB A RCPT-H: Conector Jack USB A, Through Hole, Horizontal; ChinesePrice: 0,00000; Chinês: ----; Corrente: *; Potência: *; Supplier 1: Digi-Key; Supplier Part Number 1: 609-1041-ND; Tensão: *; Tolerância: *; ComponentLink1Description: Datasheet
F3 = Res Varistor: as F2 on sheet Power-Supply; Supplier 1: Digi-Key; Supplier Part Number 1: 507-1762-1-ND; ComponentLink1Description: Datasheet; ComponentLink1URL: D:\Tecnoclade\Datasheet\!DataMissing.pdf
L7 L9 = Bd 1K@100MHz 0603 400mA: as L4 on sheet Power-Supply; Potência: *; Supplier 1: Digi-Key; Supplier Part Number 1: 445-1550-1-ND; Tensão: *; ComponentLink1Description: Datasheet; ComponentLink1URL: D:\Tecnoclade\Datasheet\!DataMissing.pdf; Substituição: 27/06/2014
L8 = ACM2012-900-2P: as L6 on sheet Power-Supply; Supplier Part Number 1: 445-2207-1-ND; Supplier 1: Digi-Key; ComponentLink1Description: Datasheet; ComponentLink1URL: D:\Tecnoclade\Datasheet\!DataMissing.pdf; Substituição: 00/00/0000
R15 R17 = Res 22R 1% 0603 1/10W: as R11 on sheet USB-Hub; Supplier 1: Digi-Key; Supplier Part Number 1: RMCF0603FT22R0CT-ND; ComponentLink1Description: Datasheet; ComponentLink1URL: D:\Tecnoclade\Datasheet\!DataMissing.pdf
R16 = Res 15K 1% 0603 1/10W: ChinesePrice: 0,00000; Chinês: -----; Corrente: *A; Potência: 1/10W; Tensão: *V; Obs: ±100ppm/ºC; Tolerância: ±1%; Supplier 1: Digi-Key; Supplier Part Number 1: RMCF0603FT15K0CT-ND; ComponentLink1Description: Datasheet; ComponentLink1URL: D:\Tecnoclade\Datasheet\!DataMissing.pdf
U7 = SP3003-02JTG: as U3 on sheet Power-Supply; Supplier Part Number 1: F3301CT-ND; Supplier 1: Digi-Key

## Nets that join several sheets
3V3: Power-Supply (C14.2 C15.2 U2.5), USB-Hub (9 pins)
5V: Power-Supply (11 pins), USB-Hub (9 pins)
GND: Power-Supply (26 pins), USB-Hub (18 pins), U_USB-Hub/USB-Port1 (7 pins), U_USB-Hub/USB-Port2 (7 pins), U_USB-Hub/USB-Port3 (7 pins), U_USB-Hub/USB-Port4 (7 pins), U_USB-Hub/USB-Port5 (7 pins), U_USB-Hub/USB-Port6 (7 pins), U_USB-Hub/USB-Port7 (7 pins)
USB0_N: Power-Supply (L6.4 U3.4), USB-Hub (R11.2)
USB0_P: Power-Supply (L6.3 U3.5), USB-Hub (R13.2)
USB_N1: USB-Hub (U6.13), U_USB-Hub/USB-Port1 (C31.1.2 R15.1.2)
USB_N2: USB-Hub (U6.17), U_USB-Hub/USB-Port2 (C31.2.2 R15.2.2)
USB_N3: USB-Hub (U6.21), U_USB-Hub/USB-Port3 (C31.3.2 R15.3.2)
USB_N4: USB-Hub (U6.26), U_USB-Hub/USB-Port4 (C31.4.2 R15.4.2)
USB_N5: USB-Hub (U6.30), U_USB-Hub/USB-Port5 (C31.5.2 R15.5.2)
USB_N6: USB-Hub (U6.34), U_USB-Hub/USB-Port6 (C31.6.2 R15.6.2)
USB_N7: USB-Hub (U6.38), U_USB-Hub/USB-Port7 (C31.7.2 R15.7.2)
USB_P1: USB-Hub (U6.14), U_USB-Hub/USB-Port1 (C32.1.2 R17.1.2)
USB_P2: USB-Hub (U6.18), U_USB-Hub/USB-Port2 (C32.2.2 R17.2.2)
USB_P3: USB-Hub (U6.22), U_USB-Hub/USB-Port3 (C32.3.2 R17.3.2)
USB_P4: USB-Hub (U6.27), U_USB-Hub/USB-Port4 (C32.4.2 R17.4.2)
USB_P5: USB-Hub (U6.31), U_USB-Hub/USB-Port5 (C32.5.2 R17.5.2)
USB_P6: USB-Hub (U6.35), U_USB-Hub/USB-Port6 (C32.6.2 R17.6.2)
USB_P7: USB-Hub (U6.39), U_USB-Hub/USB-Port7 (C32.7.2 R17.7.2)
VBUS1: USB-Hub (U4.15), U_USB-Hub/USB-Port1 (F3.1.1)
VBUS2: USB-Hub (U4.14), U_USB-Hub/USB-Port2 (F3.2.1)
VBUS3: USB-Hub (U4.11), U_USB-Hub/USB-Port3 (F3.3.1)
VBUS4: USB-Hub (U4.9), U_USB-Hub/USB-Port4 (F3.4.1)
VBUS5: USB-Hub (U5.15), U_USB-Hub/USB-Port5 (F3.5.1)
VBUS6: USB-Hub (U5.14), U_USB-Hub/USB-Port6 (F3.6.1)
VBUS7: USB-Hub (U5.11), U_USB-Hub/USB-Port7 (F3.7.1)